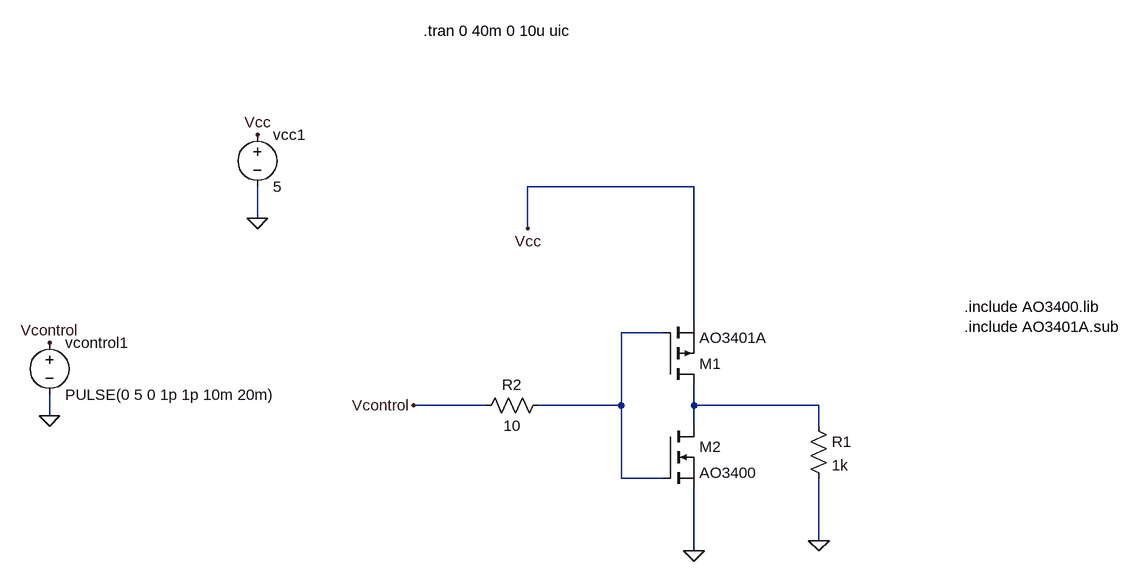
[diagram p0: schematic basico de inversor.asc]
basico de inversor.asc, the LTspice schematic file:
Version 4.1
SHEET 1 1684 680
WIRE -96 -192 -352 -192
WIRE -768 -144 -768 -192
WIRE -352 -128 -352 -192
WIRE -96 16 -96 -192
WIRE -144 32 -208 32
WIRE -416 144 -528 144
WIRE -208 144 -208 32
WIRE -208 144 -336 144
WIRE -96 144 -96 112
WIRE 96 144 -96 144
WIRE -1088 160 -1088 128
WIRE -96 176 -96 144
WIRE 96 176 96 144
WIRE -208 256 -208 144
WIRE -144 256 -208 256
WIRE 96 352 96 256
WIRE -96 368 -96 272
FLAG -96 368 0
FLAG 96 352 0
FLAG -1088 160 0
FLAG -768 -144 0
FLAG -352 -128 Vcc
FLAG -768 -272 Vcc
FLAG -528 144 Vcontrol
FLAG -1088 48 Vcontrol
DATAFLAG 32 144 ""
DATAFLAG -160 256 ""
DATAFLAG -224 144 ""
DATAFLAG -160 32 "$-V(N001)"
SYMBOL res 80 160 R0
SYMATTR InstName R1
SYMATTR Value 1k
SYMBOL pmos -144 112 M180
SYMATTR InstName M1
SYMATTR Value AO3401A
SYMATTR Prefix X
SYMBOL nmos -144 176 R0
SYMATTR InstName M2
SYMATTR Value AO3400
SYMATTR Prefix X
SYMBOL voltage -1088 32 R0
WINDOW 123 0 0 Left 0
WINDOW 39 0 0 Left 0
SYMATTR InstName vcontrol1
SYMATTR Value PULSE(0 5 0 1p 1p 10m 20m)
SYMBOL voltage -768 -288 R0
WINDOW 123 0 0 Left 0
WINDOW 39 0 0 Left 0
SYMATTR InstName vcc1
SYMATTR Value 5
SYMBOL res -320 128 R90
WINDOW 0 0 56 VBottom 2
WINDOW 3 32 56 VTop 2
SYMATTR InstName R2
SYMATTR Value 10
TEXT 320 -8 Left 2 !.include AO3400.lib\n.include AO3401A.sub
TEXT -512 -432 Left 2 !.tran 0 40m 0 10u uic

The netlist it stands for:
* basico de inversor.asc
R1 N002 0 1k
X§M1 N002 N001 Vcc AO3401A  ; pins D G S
X§M2 N002 N001 0 AO3400  ; pins D G S
vcontrol1 Vcontrol 0 PULSE(0 5 0 1p 1p 10m 20m)
vcc1 Vcc 0 5
R2 N001 Vcontrol 10
.include AO3400.lib
.include AO3401A.sub
.tran 0 40m 0 10u uic
.backanno
.end